# Altium schematic sheet top.SchDoc
size A4
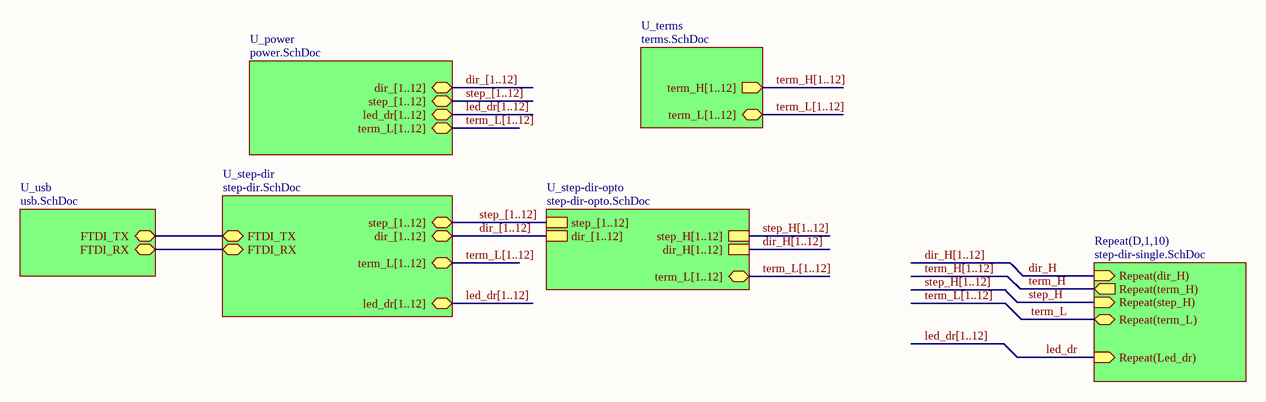
[diagram p0: top.SchDoc]

## Sub-sheets
Repeat(D,1,10) = step-dir-single.SchDoc: Repeat(dir_H) (in), Repeat(step_H) (in), Repeat(term_H) (out), Repeat(Led_dr) (in), Repeat(term_L) (bidir)
U_power = power.SchDoc: dir_[1..12], step_[1..12], led_dr[1..12], term_L[1..12]
U_step-dir = step-dir.SchDoc: step_[1..12], dir_[1..12], FTDI_TX, FTDI_RX, led_dr[1..12], term_L[1..12]
U_step-dir-opto = step-dir-opto.SchDoc: step_[1..12], dir_[1..12], step_H[1..12], dir_H[1..12], term_L[1..12]
U_terms = terms.SchDoc: term_H[1..12] (out), term_L[1..12]
U_usb = usb.SchDoc: FTDI_RX, FTDI_TX

## Nets
dir_H: sheet Repeat(D,1,10)/Repeat(dir_H)
led_dr: sheet Repeat(D,1,10)/Repeat(Led_dr)
step_H: sheet Repeat(D,1,10)/Repeat(step_H)
term_H: sheet Repeat(D,1,10)/Repeat(term_H)
term_L: sheet Repeat(D,1,10)/Repeat(term_L)
(unnamed): sheet U_step-dir/FTDI_TX, sheet U_usb/FTDI_TX
(unnamed): sheet U_step-dir/FTDI_RX, sheet U_usb/FTDI_RX

## Buses and harness runs
bus dir_[1..12] = sheet U_power/dir_[1..12]
bus dir_[1..12] = sheet U_step-dir-opto/dir_[1..12] = sheet U_step-dir/dir_[1..12]
bus dir_H[1..12]
bus dir_H[1..12] = sheet U_step-dir-opto/dir_H[1..12]
bus led_dr[1..12]
bus led_dr[1..12] = sheet U_power/led_dr[1..12]
bus led_dr[1..12] = sheet U_step-dir/led_dr[1..12]
bus step_[1..12] = sheet U_power/step_[1..12]
bus step_[1..12] = sheet U_step-dir-opto/step_[1..12] = sheet U_step-dir/step_[1..12]
bus step_H[1..12]
bus step_H[1..12] = sheet U_step-dir-opto/step_H[1..12]
bus term_H[1..12]
bus term_H[1..12] = sheet U_terms/term_H[1..12]
bus term_L[1..12]
bus term_L[1..12] = sheet U_power/term_L[1..12]
bus term_L[1..12] = sheet U_step-dir-opto/term_L[1..12]
bus term_L[1..12] = sheet U_step-dir/term_L[1..12]
bus term_L[1..12] = sheet U_terms/term_L[1..12]